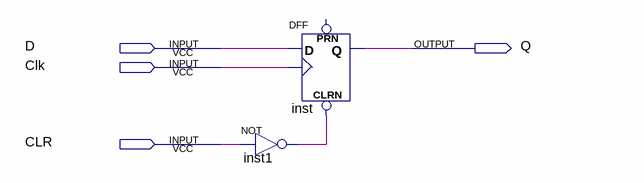
[diagram p0: schematic sheet]
// Quartus schematic CurrentState2.bdf as structural Verilog: 2 symbols, 4 pins
module CurrentState2 (
  input  D,
  input  Clk,
  input  CLR,
  output Q
);

  wire inst1_out;

  not inst1 (inst1_out, CLR);
  DFF inst (.CLRN(inst1_out), .CLK(Clk), .D(D), .Q(Q));  // open: PRN
endmodule
